# EAGLE schematic TurboPower (EAGLE 9.4.2)
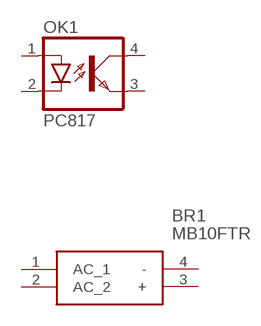
[diagram p0: schematic, sheet 1]

## Parts
BR1  MB10FTR  [SOP250P670X160-4N]
OK1  PC817  [DIL04]
Unconnected: BR1.1(AC_1) BR1.2(AC_2) BR1.3(+) BR1.4(-) OK1.1(A) OK1.2(C) OK1.3(EMIT) OK1.4(COL)

## Library data of the parts
BR1 = MB10FTR:MB10FTR: MB05F THRU MB10F SINGLE PHASE 0.8AMP SURFACE MOUNT GLASS PASSIVATED BRIDGE RECTIFIER Source: Datasheet <http://www.smc-diodes.com/propdf/MB05F-MB10F N1456 REV.A.pdf>; DESCRIPTION: MB05F THRU MB10F SINGLE PHASE 0.8AMP SURFACE MOUNT GLASS PASSIVATED BRIDGE RECTIFIER; HEIGHT: 1.6mm; MANUFACTURER_NAME: SMC Diode Solutions; MANUFACTURER_PART_NUMBER: MB10FTR
OK1 = optocoupler:PC817: SHARP OPTO COUPLER; MPN: PC817X4J000F; OC_FARNELL: 9707727; OC_NEWARK: 97K7059